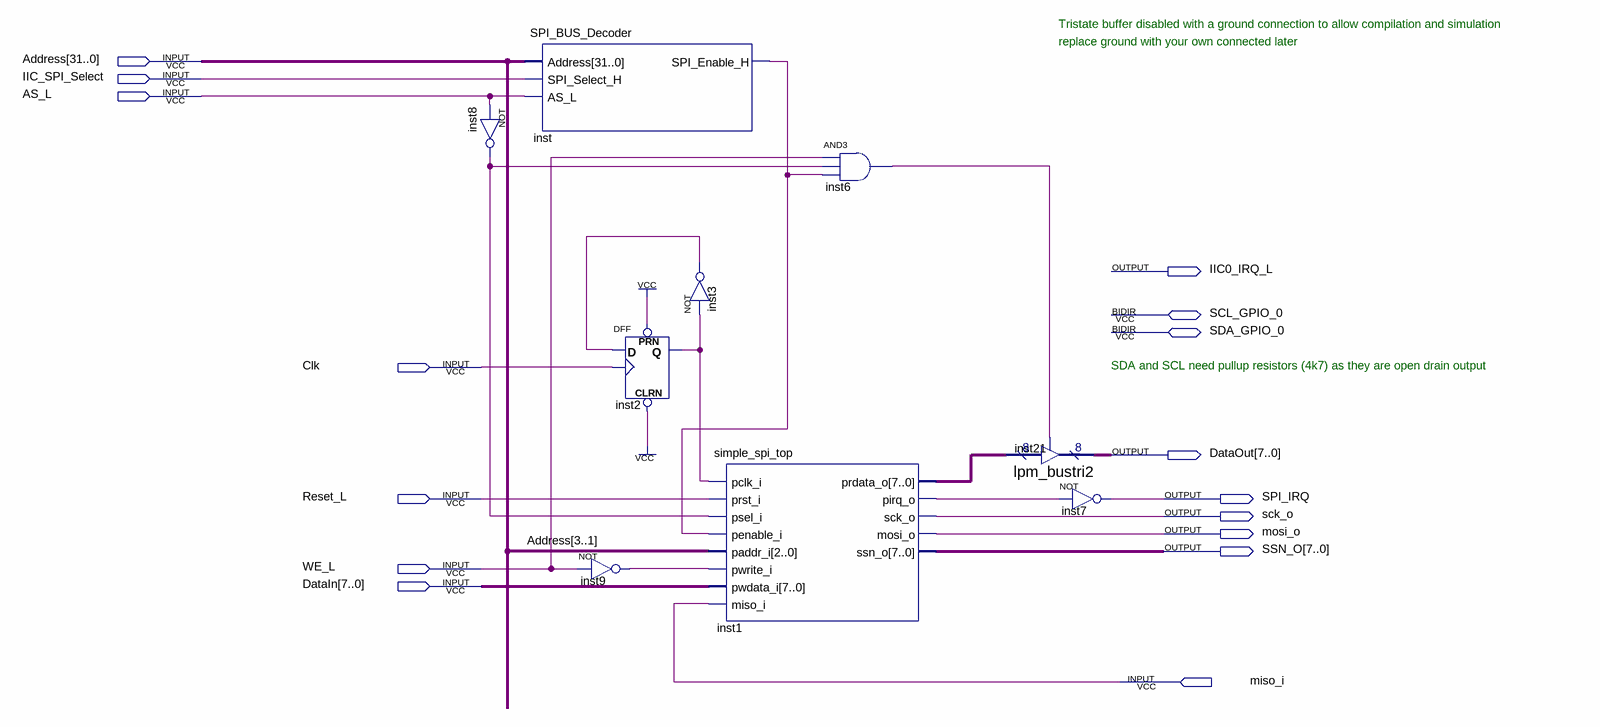
[diagram p0: schematic sheet]
// Quartus schematic IIC_SPI_Interface.bdf as structural Verilog: 9 symbols, 16 pins
module IIC_SPI_Interface (
  input  [31:0] Address,
  input  IIC_SPI_Select,
  input  AS_L,
  input  Clk,
  input  Reset_L,
  input  WE_L,
  input  [7:0] DataIn,
  input  miso_i,
  inout  SCL_GPIO_0,
  inout  SDA_GPIO_0,
  output IIC0_IRQ_L,
  output [7:0] DataOut,
  output SPI_IRQ,
  output sck_o,
  output mosi_o,
  output [7:0] SSN_O
);

  wire inst1_pirq_o, inst2_q, inst3_out, inst6_out, inst8_out, inst9_out, inst_spi_enable_h;
  wire [7:0] inst1_prdata_o;

  SPI_BUS_Decoder inst (
    .Address(Address), .SPI_Select_H(IIC_SPI_Select), .AS_L(AS_L), .SPI_Enable_H(inst_spi_enable_h));
  not inst8 (inst8_out, AS_L);
  not inst9 (inst9_out, WE_L);
  DFF inst2 (.CLRN(1'b1), .CLK(Clk), .D(inst3_out), .PRN(1'b1), .Q(inst2_q));
  not inst3 (inst3_out, inst2_q);
  simple_spi_top inst1 (
    .pclk_i(inst2_q), .prst_i(Reset_L), .psel_i(inst8_out), .penable_i(inst_spi_enable_h),
    .paddr_i(Address[3:1]), .pwrite_i(inst9_out), .pwdata_i(DataIn), .miso_i(miso_i),
    .prdata_o(inst1_prdata_o), .pirq_o(inst1_pirq_o), .sck_o(sck_o), .mosi_o(mosi_o), .ssn_o(SSN_O));
  and inst6 (inst6_out, WE_L, inst8_out, inst_spi_enable_h);
  lpm_bustri2 inst21 (.enabledt(inst6_out), .data(inst1_prdata_o), .tridata(DataOut));
  not inst7 (SPI_IRQ, inst1_pirq_o);

  // Notes on the sheet:
  //   Tristate buffer disabled with a ground connection to allow compilation and simulation
  //   replace ground with your own connected later
  //   SDA and SCL need pullup resistors (4k7) as they are open drain output
endmodule
